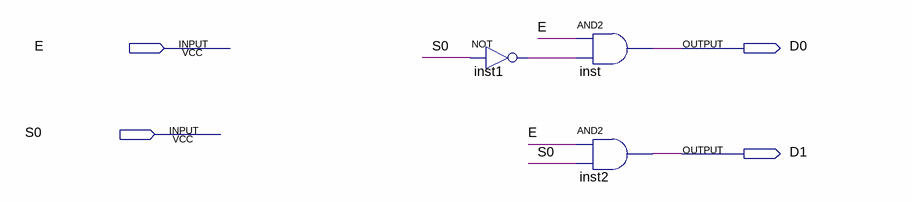
[diagram p0: schematic sheet]
// Quartus schematic dcd1-2.bdf as structural Verilog: 3 symbols, 4 pins
module \dcd1-2  (
  input  E,
  input  S0,
  output D0,
  output D1
);

  wire inst1_out;

  not inst1 (inst1_out, S0);
  and inst (D0, E, inst1_out);
  and inst2 (D1, E, S0);
endmodule
